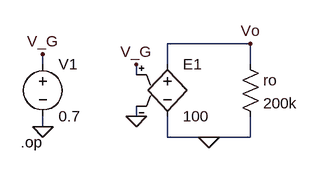
[diagram p0: schematic voltageDependentVoltageSource.asc]
voltageDependentVoltageSource.asc, the LTspice schematic file:
Version 4
SHEET 1 880 680
WIRE 352 80 224 80
WIRE 32 112 32 96
WIRE 224 112 224 80
WIRE 352 112 352 80
WIRE 176 128 176 112
WIRE 176 192 176 176
WIRE 32 208 32 192
WIRE 224 224 224 192
WIRE 288 224 224 224
WIRE 352 224 352 192
WIRE 352 224 288 224
FLAG 176 112 V_G
FLAG 176 192 0
FLAG 32 208 0
FLAG 32 96 V_G
FLAG 352 80 Vo
FLAG 288 224 0
SYMBOL e 224 96 R0
SYMATTR InstName E1
SYMATTR Value 100
SYMBOL res 336 96 R0
SYMATTR InstName ro
SYMATTR Value 200k
SYMBOL voltage 32 96 R0
SYMATTR InstName V1
SYMATTR Value 0.7
TEXT -2 232 Left 2 !.op

The netlist it stands for:
* voltageDependentVoltageSource.asc
E1 Vo 0 V_G 0 100
ro Vo 0 200k
V1 V_G 0 0.7
.op
.backanno
.end